# Altium schematic sheet DayGreen_revres_v00.SchDoc
size A2
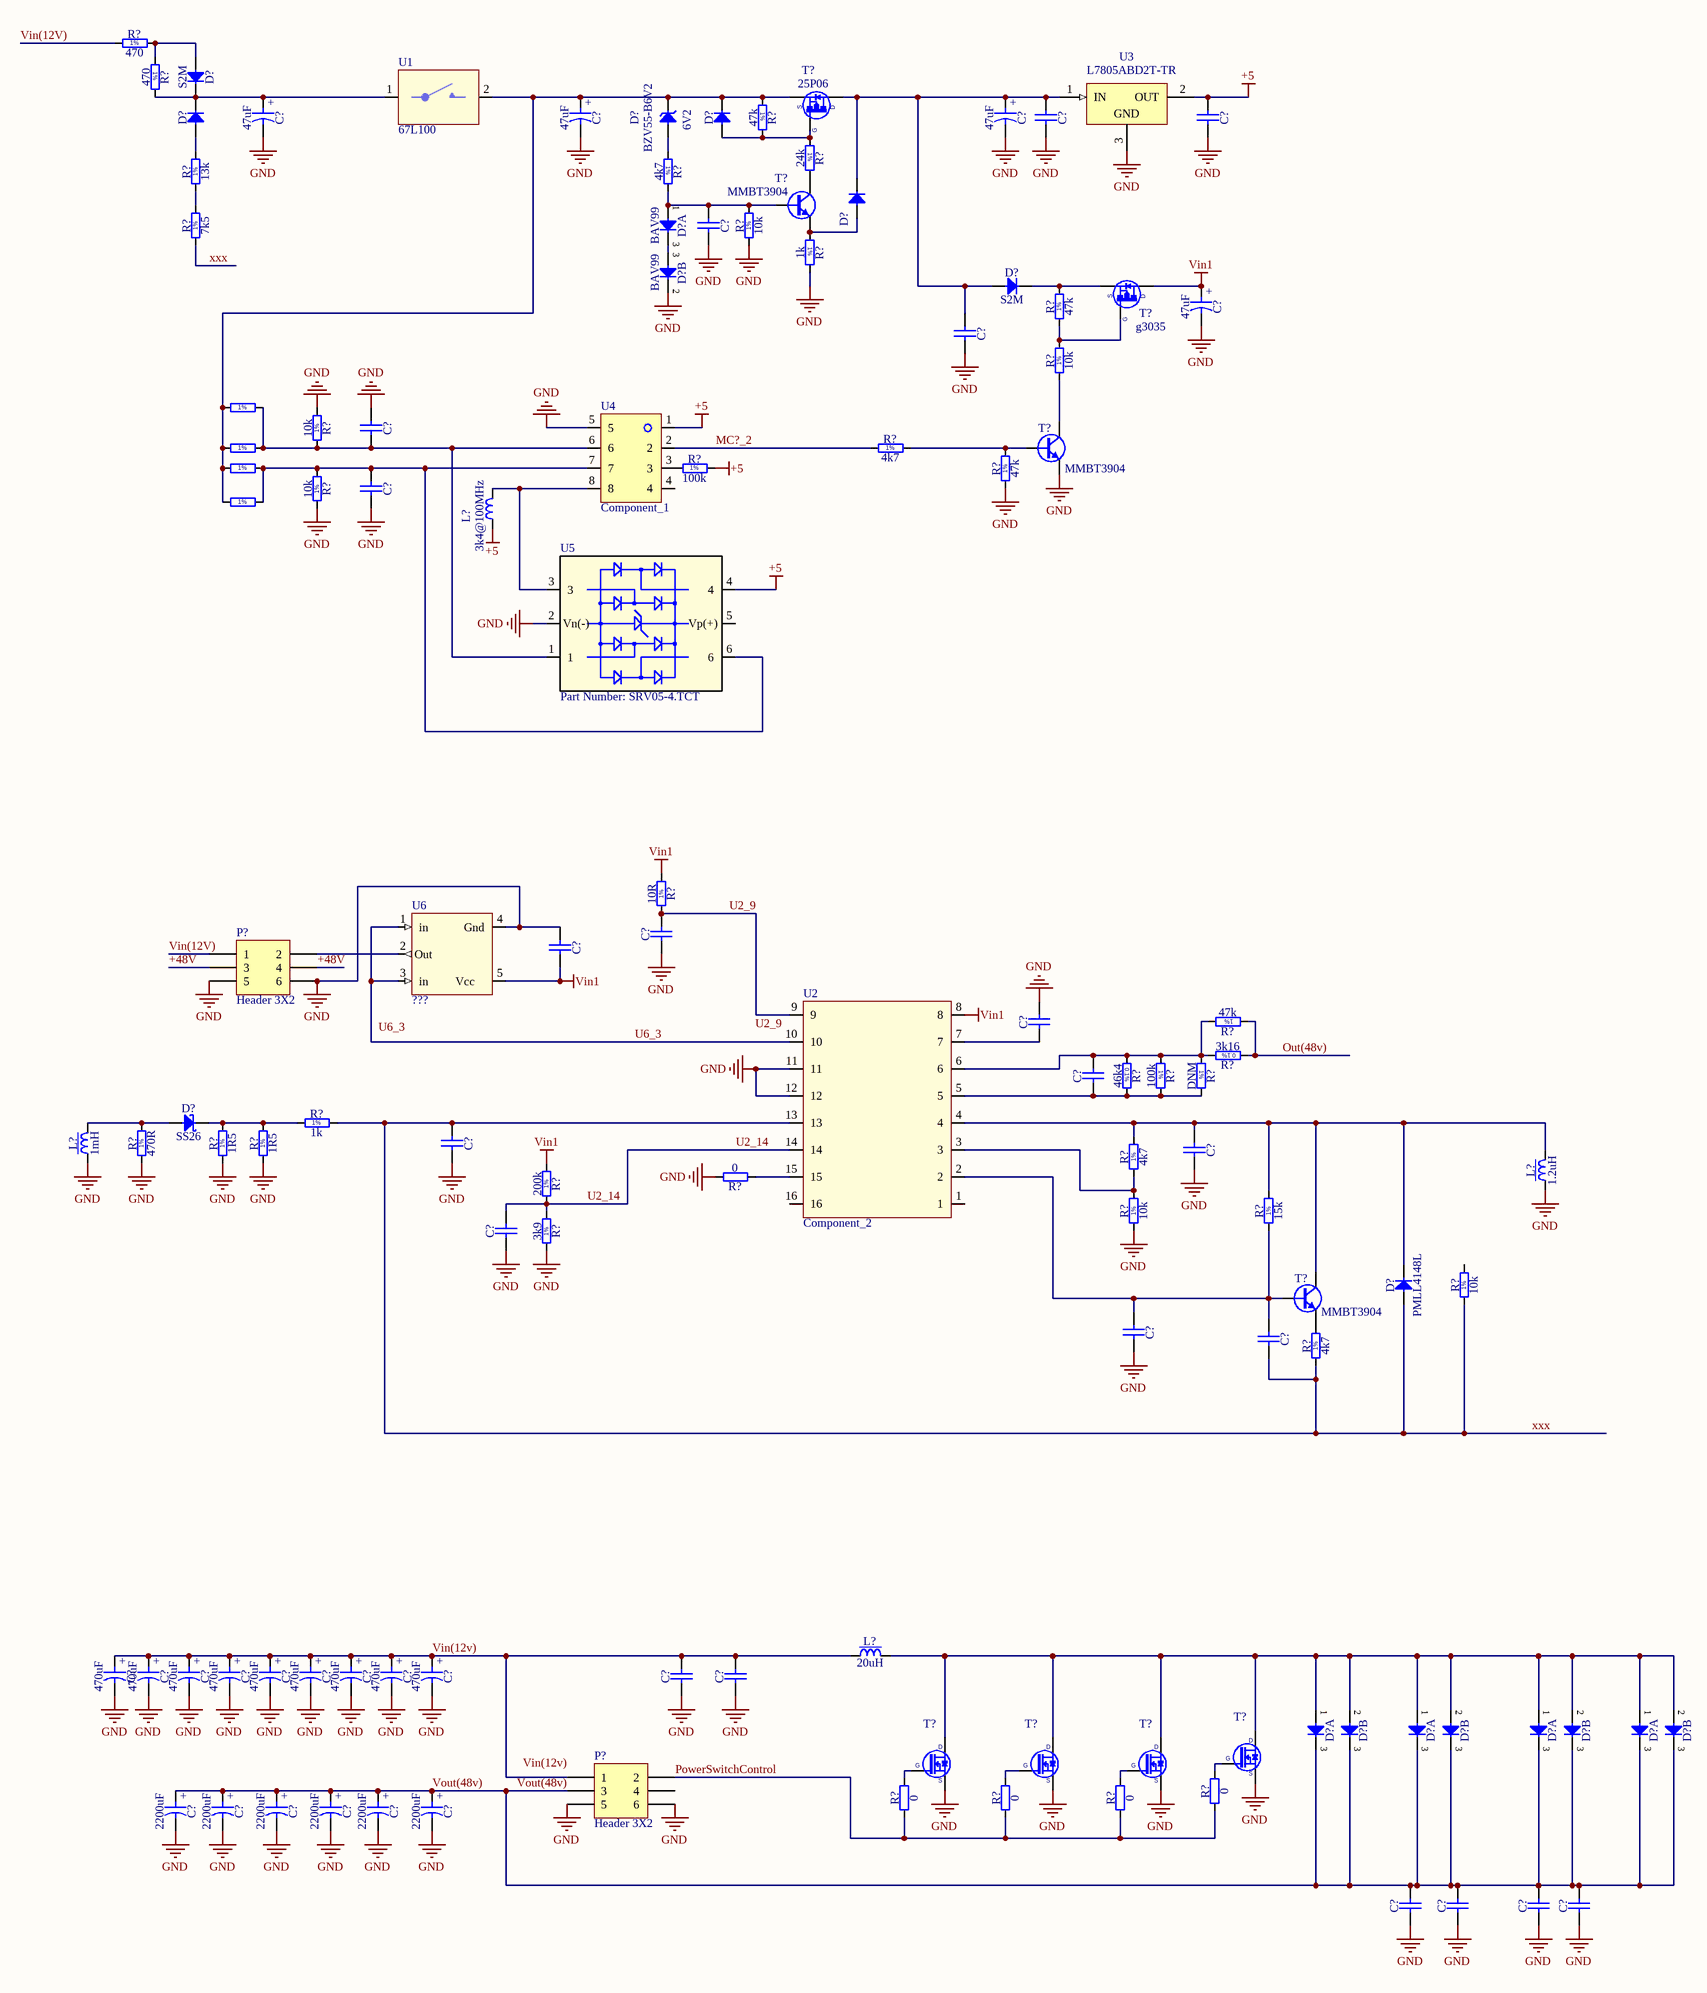
[diagram p0: DayGreen_revres_v00.SchDoc]

## Parts
(Parts that share a designator on the sheet are numbered #1, #2 ... from top to bottom, then left to right.)
C?#1  47uF  [CAPPR350-800X1150]
C?#2  47uF  [CAPPR350-800X1150]
C?#3  47uF  [CAPPR350-800X1150]
C?#4  1nF  [CAPC2012X88N]  (value not drawn)
C?#5  1nF  [CAPC2012X88N]  (value not drawn)
C?#6  1nF  [CAPC2012X88N]  (value not drawn)
C?#7  47uF  [CAPPR350-800X1150]
C?#8  1nF  [CAPC2012X88N]  (value not drawn)
C?#9  100nF  [CAPC1608X87N]  (value not drawn)
C?#10  100nF  [CAPC1608X87N]  (value not drawn)
C?#11  1nF  [CAPC2012X88N]  (value not drawn)
C?#12  1nF  [CAPC2012X88N]  (value not drawn)
C?#13  1nF  [CAPC2012X88N]  (value not drawn)
C?#14  1nF  [CAPC2012X88N]  (value not drawn)
C?#15  1nF  [CAPC2012X88N]  (value not drawn)
C?#16  1nF  [CAPC2012X88N]  (value not drawn)
C?#17  1nF  [CAPC2012X88N]  (value not drawn)
C?#18  1nF  [CAPC2012X88N]  (value not drawn)
C?#19  1nF  [CAPC2012X88N]  (value not drawn)
C?#20  470uF  [CAPPR500-1300X3200]
C?#21  470uF  [CAPPR500-1300X3200]
C?#22  470uF  [CAPPR500-1300X3200]
C?#23  470uF  [CAPPR500-1300X3200]
C?#24  470uF  [CAPPR500-1300X3200]
C?#25  470uF  [CAPPR500-1300X3200]
C?#26  470uF  [CAPPR500-1300X3200]
C?#27  470uF  [CAPPR500-1300X3200]
C?#28  470uF  [CAPPR500-1300X3200]
C?#29  100nF  [CAPC3216X140N]  (value not drawn)
C?#30  100nF  [CAPC3216X140N]  (value not drawn)
C?#31  2200uF  [CAPPR750-1650X2200]
C?#32  2200uF  [CAPPR750-1650X2200]
C?#33  2200uF  [CAPPR750-1650X2200]
C?#34  2200uF  [CAPPR750-1650X2200]
C?#35  2200uF  [CAPPR750-1650X2200]
C?#36  2200uF  [CAPPR750-1650X2200]
C?#37  100nF  [CAPC3216X140N]  (value not drawn)
C?#38  100nF  [CAPC3216X140N]  (value not drawn)
C?#39  100nF  [CAPC3216X140N]  (value not drawn)
C?#40  100nF  [CAPC3216X140N]  (value not drawn)
D?#1  S2M  [DIOM5336X265N]
D?#2  PMLL4148L  [DIOMELF3515N]  (value not drawn)
D?#3  BZV55-B6V2  Voltage: 6V2  [DIOMELF3515N]
D?#4  PMLL4148L  [DIOMELF3515N]  (value not drawn)
D?#5  BAV99  [SOT95P240X110-3N]  (part A of 2)
D?#6  PMLL4148L  [DIOMELF3515N]  (value not drawn)
D?#7  BAV99  [SOT95P240X110-3N]  (part B of 2)
D?#8  S2M  [DIOM5336X265N]
D?#9  SS26  [DIOM5336X265N]
D?#10  PMLL4148L  [DIOMELF3515N]
D?#11  STPS41H100C  [TO254P1542X460-3N-R820X1040]  (value not drawn)  (part A of 2)
D?#12  STPS41H100C  [TO254P1542X460-3N-R820X1040]  (value not drawn)  (part B of 2)
D?#13  STPS41H100C  [TO254P1542X460-3N-R820X1040]  (value not drawn)  (part A of 2)
D?#14  STPS41H100C  [TO254P1542X460-3N-R820X1040]  (value not drawn)  (part B of 2)
D?#15  STPS41H100C  [TO254P1542X460-3N-R820X1040]  (value not drawn)  (part A of 2)
D?#16  STPS41H100C  [TO254P1542X460-3N-R820X1040]  (value not drawn)  (part B of 2)
D?#17  STPS41H100C  [TO254P1542X460-3N-R820X1040]  (value not drawn)  (part A of 2)
D?#18  STPS41H100C  [TO254P1542X460-3N-R820X1040]  (value not drawn)  (part B of 2)
L?#1  3k4@100MHz  [INDC2012X110N]
L?#2  1mH  [IND_BOURNS_2124-V-RC]
L?#3  1.2uH  [INDC2014X145N]
L?#4  20uH  [IND_COOPER_CTX20-16-52-R]
P?#1  Header 3X2  [HDR2X3]
P?#2  Header 3X2  [HDR2X3]
R?#1  470  [RESC3146X65N]
R?#2  470  [RESC3146X65N]
R?#3  47k  [RESC2012X60N]
R?#4  24k  [RESC3216X65N]
R?#5  4k7  [RESC2012X60N]
R?#6  13k  [RESC2012X60N]
R?#7  1k  [RESC3216X65N]
R?#8  7k5  [RESC2012X60N]
R?#9  10k  [RESC1608X55N]
R?#10  47k  [RESC1608X55N]
R?#11  10k  [RESC1608X55N]
R?#12  10k  [RESC1608X55N]  (value not drawn)
R?#13  10k  [RESC1608X55N]  (value not drawn)
R?#14  10k  [RESC1608X55N]
R?#15  4k7  [RESC1608X55N]
R?#16  10k  [RESC1608X55N]  (value not drawn)
R?#17  100k  [RESC1608X55N]
R?#18  47k  [RESC1608X55N]
R?#19  10k  [RESC1608X55N]  (value not drawn)
R?#20  10k  [RESC1608X55N]
R?#21  10R  [RESC2012X60N]
R?#22  47k  [RESC2012X60N]
R?#23  46k4  [RESC2012X60N]
R?#24  100k  [RESC2012X60N]
R?#25  DNM  [RESC2012X60N]
R?#26  3k16  [RESC2012X60N]
R?#27  1k  [RESC2012X60N]
R?#28  470R  [RESC3216X65N]
R?#29  1R5  [RESC3225X70N]
R?#30  1R5  [RESC3225X70N]
R?#31  0  [RESC2012X60N]
R?#32  4k7  [RESC2012X60N]
R?#33  200k  [RESC2012X60N]
R?#34  10k  [RESC2012X60N]
R?#35  15k  [RESC2012X60N]
R?#36  3k9  [RESC2012X60N]
R?#37  10k  [RESC2012X60N]
R?#38  4k7  [RESC2012X60N]
R?#39  0  [RESC2012X60N]
R?#40  0  [RESC2012X60N]
R?#41  0  [RESC2012X60N]
R?#42  0  [RESC2012X60N]
T?#1  25P06  [TO254P1524X483-3N-R1067X686]
T?#2  MMBT3904  [SOT95P230X110-3N]
T?#3  g3035  [SOT95P240X130-3N]
T?#4  MMBT3904  [SOT95P230X110-3N]
T?#5  MMBT3904  [SOT95P230X110-3N]
T?#6  HY4008  [TO228P991X239-3N-R552X520]  (value not drawn)
T?#7  HY4008  [TO228P991X239-3N-R552X520]  (value not drawn)
T?#8  HY4008  [TO228P991X239-3N-R552X520]  (value not drawn)
T?#9  HY4008  [TO228P991X239-3N-R552X520]  (value not drawn)
U1  67L100
U2  Component_2
U3  L7805ABD2T-TR  [TO254P1542X460-3N-R790X1040]
U4  Component_1
U5  Part Number: SRV05-4.TCT  [SO6_SOT23-6L]
U6  ???

## Nets
+5: C?#5.1 L?#1.1 R?#17.1 U3.2(OUT) U4.1 U5.4
GND: C?#1.2 C?#2.2 C?#3.2 C?#4.2 C?#5.2 C?#6.2 C?#7.2 C?#8.2 C?#9.2 C?#10.1 C?#11.1 C?#12.1 C?#13.1 C?#15.1 C?#16.1 C?#17.1 C?#18.1 C?#20.2 C?#21.2 C?#22.2 C?#23.2 C?#24.2 C?#25.2 C?#26.2 C?#27.2 C?#28.2 C?#29.1 C?#30.1 C?#31.2 C?#32.2 C?#33.2 C?#34.2 C?#35.2 C?#36.2 C?#37.1 C?#38.1 C?#39.1 C?#40.1 D?#7.2(C) L?#2.1 L?#3.1 P?#1.5 P?#1.6 P?#2.5 P?#2.6 R?#7.2 R?#9.1 R?#14.2 R?#18.1 R?#20.1 R?#28.1 R?#29.1 R?#30.1 R?#31.2 R?#34.1 R?#36.1 T?#4.2(E) T?#6.2(S) T?#7.2(S) T?#8.2(S) T?#9.2(S) U2.11 U2.12 U3.3(GND) U4.5 U5.2(Vn(-)) U6.4(Gnd)
Vin1: C?#7.1 C?#11.2 R?#21.2 R?#33.2 T?#3.3(D) U2.8 U6.5(Vcc)
+48V: P?#1.3 P?#1.4
MC?_2: R?#15.1 U4.2
Out(48v): R?#22.1 R?#26.1
PowerSwitchControl: P?#2.2 R?#39.1 R?#40.1 R?#41.1 R?#42.1
U2_9: C?#12.2 R?#21.1 U2.9
U2_14: C?#17.2 R?#33.1 R?#36.2 U2.14
U6_3: U2.10 U6.1(in) U6.3(in)
Vin(12V): C?#20.1 C?#21.1 C?#22.1 C?#23.1 C?#24.1 C?#25.1 C?#26.1 C?#27.1 C?#28.1 C?#29.2 C?#30.2 L?#4.1 P?#1.1 P?#2.1 R?#1.1
Vout(48v): C?#31.1 C?#32.1 C?#33.1 C?#34.1 C?#35.1 C?#36.1 C?#37.2 C?#38.2 C?#39.2 C?#40.2 D?#11.3(COMC) D?#12.3(COMC) D?#13.3(COMC) D?#14.3(COMC) D?#15.3(COMC) D?#16.3(COMC) D?#17.3(COMC) D?#18.3(COMC) P?#2.3
xxx: C?#15.2 C?#19.1 D?#10.2(A) R?#8.1 R?#27.2 R?#37.1 R?#38.1 U2.13
NetC?#1_1: C?#1.1 D?#1.1(C) D?#2.1(C) R?#2.2 U1.1
NetC?#2_1: C?#2.1 D?#3.1(C) D?#4.1(C) R?#3.1 R?#12.2 R?#13.2 R?#16.2 R?#19.2 T?#1.2(S) U1.2
NetC?#3_1: C?#3.1 C?#4.1 C?#8.1 D?#6.1(C) D?#8.2(A) T?#1.3(D) U3.1(IN)
NetC?#6_1: C?#6.1 D?#5.1(A) R?#5.2 R?#9.2 T?#2.1(B)
NetC?#9_1: C?#9.1 R?#12.1 R?#13.1 R?#14.1 U4.6 U5.1
NetC?#10_2: C?#10.2 R?#16.1 R?#19.1 R?#20.2 U4.7 U5.6
NetC?#13_2: C?#13.2 U2.7
NetC?#14_1: C?#14.1 R?#22.2 R?#23.1 R?#24.1 R?#25.1 R?#26.2 U2.6
NetC?#14_2: C?#14.2 R?#23.2 R?#24.2 R?#25.2 U2.5
NetC?#16_2: C?#16.2 D?#10.1(C) L?#3.2 R?#32.2 R?#35.2 T?#5.3(C) U2.4
NetC?#18_2: C?#18.2 C?#19.2 R?#35.1 T?#5.1(B) U2.2
NetD?#1_2: D?#1.2(A) R?#1.2 R?#2.1
NetD?#2_2: D?#2.2(A) R?#6.2
NetD?#3_2: D?#3.2(A) R?#5.1
NetD?#4_2: D?#4.2(A) R?#3.2 R?#4.1 T?#1.1(G)
NetD?#5_3: D?#5.3(COMAC) D?#7.3(COMAC)
NetD?#6_2: D?#6.2(A) R?#7.1 T?#2.2(E)
NetD?#8_1: D?#8.1(C) R?#10.2 T?#3.2(S)
NetD?#9_1: D?#9.1(C) R?#27.1 R?#29.2 R?#30.2
NetD?#9_2: D?#9.2(A) L?#2.2 R?#28.2
NetD?#11_1: D?#11.1(A) D?#12.2(A) D?#13.1(A) D?#14.2(A) D?#15.1(A) D?#16.2(A) D?#17.1(A) D?#18.2(A) L?#4.2 T?#6.3(D) T?#7.3(D) T?#8.3(D) T?#9.3(D)
NetL?#1_2: L?#1.2 U4.8 U5.3
NetP?#1_2: P?#1.2 U6.2(Out)
NetR?#4_2: R?#4.2 T?#2.3(C)
NetR?#6_1: R?#6.1 R?#8.2
NetR?#10_1: R?#10.1 R?#11.2 T?#3.1(G)
NetR?#11_1: R?#11.1 T?#4.3(C)
NetR?#15_2: R?#15.2 R?#18.2 T?#4.1(B)
NetR?#17_2: R?#17.2 U4.3
NetR?#31_1: R?#31.1 U2.15
NetR?#32_1: R?#32.1 R?#34.2 U2.3
NetR?#38_2: R?#38.2 T?#5.2(E)
NetR?#39_2: R?#39.2 T?#6.1(G)
NetR?#40_2: R?#40.2 T?#7.1(G)
NetR?#41_2: R?#41.2 T?#8.1(G)
NetR?#42_2: R?#42.2 T?#9.1(G)

Not connected (* = marked no-connect by the designer): P?#2 4; R?#37 2; U2 1 16; U4 4; U5 5(Vp(+))

## Notes on the sheet
- Labels drawn without touching a wire or pin: U6_3, Vin(12v)
- Title
- Size:
- Date:
- File:
- A2
- Number:
- Time:
- Revision:
- Sheet
- of
- (in symbol CAER_47UF_63V_20%_350-800X1150) +
- (in symbol CAER_470UF_63V_20%_PANASONIC_EEUFC1J471L) +
- (in symbol CAER_2200UF_25V_20%_RUBYCON_ZLH) +
- (in symbol R0603_4K7_1%_0.1W_100PPM) 1%
- (in symbol R0603_10K_1%_0.1W_100PPM) 1%
- (in symbol R0603_47K_1%_0.1W_100PPM) 1%
- (in symbol R0603_100K_1%_0.1W_100PPM) 1%
- (in symbol R0805_1K_1%_0.33W_100PPM_VISHAY_CRCW-HP) 1%
- (in symbol R0805_1K_1%_0.125W_100PPM) 1%
- (in symbol R0805_3K9_1%_0.125W_100PPM) 1%
- (in symbol R0805_3K16_0.1%_0.1W_10PPM) 0.1%
- (in symbol R0805_4K7_1%_0.125W_100PPM) 1%
- (in symbol R0805_7K5_1%_0.125W_100PPM) 1%
- (in symbol R0805_10K_1%_0.125W_100PPM) 1%
- (in symbol R0805_13K_1%_0.125W_100PPM) 1%
- (in symbol R0805_15K_1%_0.125W_100PPM) 1%
- (in symbol R0805_46K4_0.1%_0.1W_10PPM) 0.1%
- (in symbol R0805_47K_1%_0.125W_100PPM) 1%
- (in symbol R0805_100K_1%_0.125W_100PPM) 1%
- (in symbol R0805_200K_1%_0.125W_100PPM) 1%
- (in symbol R1206_1K_1%_0.25W_100PPM) 1%
- (in symbol R1206_24K_1%_0.25W_100PPM) 1%
- (in symbol R1206_24R_1%_0.25W_100PPM) 1%
- (in symbol R1210_49R9_1%_0.5W_100PPM_VISHAY_CRCW) 1%
- (in symbol R1218_470R_1%_1W_100PPM) 1%

## Library data of the parts
C?#1-C?#3 C?#7 = CAER_47UF_63V_20%_350-800X1150: Polarised capacitor; Part Description: Aluminum Electrolytic Capacitor; Manufacturer: GENERIC; Manufacturer1 Part Number: EEUFC1J470; Voltage: 63V; Tolerance: ±20%; Part Number: CAER_47UF_63V_20%_350-800X1150; Component Kind: Standard; Component Type: Standard; Pin Count: 2; Value: 47uF; Status: Preferred; Manufacturer Part Number: CAER_47UF_63V_20%_350-800X1150; Case: LS3.5 D8 x H11.5; Mounted: Yes; Socket: No; SMD: No; Sense: No; ComponentHeight: 11.5mm; Manufacturer1 Example: PANASONIC; Manufacturer1 ComponentHeight: 11.5mm; HelpURL: \\cern.ch\dfs\Applications\Altium\Datasheets\CAER_PANASONIC_FC.pdf; Author: CERN DEM JLC; CreateDate: 18.12.2007; LatestRevisionDate: 18.12.2007
C?#4-C?#6 C?#8 C?#11-C?#19 = CC0805_1NF_50V_5%_C0G_KEMET_C0805C102J5GACAUTO: Non-polarised capacitor; Part Description: SMD Multilayer Chip Ceramic Capacitor (Automotive Grade); Manufacturer: KEMET; Voltage: 50V; TC: C0G/NP0; Tolerance: ±5%; Part Number: CC0805_1NF_50V_5%_C0G_KEMET_C0805C102J5GACAUTO; Component Kind: Standard; Component Type: Standard; Pin Count: 2; Value: 1nF; Status: Not Recommended; Manufacturer Part Number: C0805C102J5GACAUTO; Case: 0805; Mounted: Yes; Socket: No; SMD: Yes; Sense: No; ComponentHeight: 0.88mm; HelpURL: \\cern.ch\dfs\Applications\Altium\Datasheets\CC0805_KEMET_C0805C102J5GACAUTO.pdf; Author: CERN DEM BC
  C?#4-C?#6 C?#8 C?#11: CreateDate: 26.02.2016; LatestRevisionDate: 26.02.2016
  C?#12-C?#19: CreateDate: 2/26/2016; LatestRevisionDate: 2/26/2016
C?#9 C?#10 = CC0603_100NF_50V_10%_X5R: Non-polarised capacitor; Part Description: SMD Multilayer Chip Ceramic Capacitor; Manufacturer: GENERIC; Manufacturer1 Part Number: C1608X5R1H104K080AA; Voltage: 50V; TC: X5R; Tolerance: ±10%; Part Number: CC0603_100NF_50V_10%_X5R; Component Kind: Standard; Component Type: Standard; Pin Count: 2; Value: 100nF; Status: None; Manufacturer Part Number: CC0603_100NF_50V_10%_X5R; Case: 0603; Mounted: Yes; Socket: No; SMD: Yes; Sense: No; Manufacturer1 Example: TDK; Manufacturer1 ComponentHeight: 0.9mm; HelpURL: \\cern.ch\dfs\Applications\Altium\Datasheets\CC0603_X5R_TDK_C.pdf; Author: CERN DEM MR; CreateDate: 08.01.2016; LatestRevisionDate: 08.01.2016
C?#20-C?#28 = CAER_470UF_63V_20%_PANASONIC_EEUFC1J471L: Polarised capacitor; Part Description: Z= 0R055, Radial Lead, Aluminum Electrolytic Capacitor, (FC Series, Type A); Voltage: 63V; Tolerance: ±20%; Part Number: CAER_470UF_63V_20%_PANASONIC_EEUFC1J471L; Component Kind: Standard; Component Type: Standard; Pin Count: 2; Value: 470uF; Status: None; Manufacturer: PANASONIC; Manufacturer Part Number: EEUFC1J471L; Case: LS5 D12.5 x H30; Mounted: Yes; Socket: No; SMD: No; Sense: No; ComponentHeight: 32mm; HelpURL: \\cern.ch\dfs\Applications\Altium\Datasheets\CAER_PANASONIC_FC-A.pdf; Author: CERN DEM MR; CreateDate: 17.02.2016; LatestRevisionDate: 17.02.2016
C?#29 C?#30 C?#37-C?#40 = CC1206_100NF_200V_10%_X7R: Non-polarised capacitor; Part Description: SMD Ceramic Chip Capacitor; Manufacturer: GENERIC; Manufacturer1 Part Number: C1206C104K2RAC; Voltage: 200V; TC: X7R; Tolerance: ±10%; Part Number: CC1206_100NF_200V_10%_X7R; Component Kind: Standard; Component Type: Standard; Pin Count: 2; Value: 100nF; Status: None; Manufacturer Part Number: CC1206_100NF_200V_10%_X7R; Case: 1206; Mounted: Yes; Socket: No; SMD: Yes; Sense: No; Manufacturer1 Example: KEMET; Manufacturer1 ComponentHeight: 1.4mm; HelpURL: \\cern.ch\dfs\Applications\Altium\Datasheets\CC1206_X7R_KEMET.pdf; Author: CERN DEM JLC; CreateDate: 16.09.2009; LatestRevisionDate: 16.09.2009
C?#31-C?#36 = CAER_2200UF_25V_20%_RUBYCON_ZLH: Polarised capacitor; Part Description: Miniature Aluminum Electrolytic Capacitor (Series: ZLH); Manufacturer Part Number: 25ZLH2200MEFC16X20; Voltage: 25V; Tolerance: ±20%; Part Number: CAER_2200UF_25V_20%_RUBYCON_ZLH; Component Kind: Standard; Component Type: Standard; Pin Count: 2; Value: 2200uF; Status: Preferred; Manufacturer: RUBYCON; Case: LS7.5 D16.5 x H22; Mounted: Yes; Socket: No; SMD: No; Sense: No; ComponentHeight: 22mm; HelpURL: \\cern.ch\dfs\Applications\Altium\Datasheets\CAER_RUBYCON_ZLH.pdf; Author: CERN DEM JLC; CreateDate: 03.07.2012; LatestRevisionDate: 03.07.2012
D?#1 D?#8 = S2M: Diode; Part Description: General Purpose Rectifiers (Glass Passivated); Manufacturer: FAIRCHILD SEMICONDUCTOR; Voltage: 1000V; Power: 2A; PressFit: No; Bonding: No; Part Number: S2M; Component Kind: Standard; Component Type: Standard; Device: S2M; PackageDescription: DO-214-AA/SMB Diode, Molded Body; 5.34mm L X 3.625mm W X 2.65mm H, IPC Medium Density; Manufacturer Part Number: S2M; Pin Count: 2; Case: DO-214AA; Mounted: Yes; Socket: No; SMD: Yes; Sense: No; ComponentHeight: 2.65mm; HelpURL: \\cern.ch\dfs\Applications\Altium\Datasheets\S2M.pdf; Author: CERN DEM JLC; CreateDate: 26.04.2011; LatestRevisionDate: 26.04.2011
D?#2 D?#4 D?#6 D?#10 = PMLL4148L: Diode; Part Description: High-speed switching diodes; Manufacturer: NXP SEMICONDUCTORS; Voltage: 75V; Power: 200mA; PressFit: No; Bonding: No; Part Number: PMLL4148L; Component Kind: Standard; Component Type: Standard; Device: PMLL4148L; PackageDescription: SOD80C, MELF Diode, 2-Leads, Body 3.5x1.5mm, IPC Medium Density; Status: Not recommended; Manufacturer Part Number: PMLL4148L; Pin Count: 2; Case: SOD-80C; Mounted: Yes; Socket: No; SMD: Yes; Sense: No; ComponentHeight: 1.6mm; HelpURL: \\cern.ch\dfs\Applications\Altium\Datasheets\PMLL4148L.pdf; Author: CERN DEM JLC
  D?#2 D?#4 D?#6: CreateDate: 30.03.2009; LatestRevisionDate: 09.12.2009
  D?#10: CreateDate: 3/30/2009; LatestRevisionDate: 12/9/2009
D?#3 = BZV55-B6V2: Zener Diode; Part Description: Voltage Regulator Diode; Manufacturer: NXP SEMICONDUCTORS; Power: 500mW; PressFit: No; Bonding: No; Part Number: BZV55-B6V2; Component Kind: Standard; Component Type: Standard; Device: BZV55-B6V2; PackageDescription: SOD80C, MELF Diode, 2-Leads, Body 3.5x1.5mm, IPC Medium Density; Manufacturer Part Number: BZV55-B6V2; Pin Count: 2; Case: SOD-80C; Mounted: Yes; Socket: No; SMD: Yes; Sense: No; ComponentHeight: 1.6mm; HelpURL: \\cern.ch\dfs\Applications\Altium\Datasheets\BZV55.pdf; Author: CERN DEM JLC; CreateDate: 5/6/2008; LatestRevisionDate: 5/6/2008
D?#5 D?#7 = BAV99: Serial Diode; Part Description: Dual Series Signal Diode; Manufacturer: FAIRCHILD SEMICONDUCTOR; Voltage: 70V; Power: 350mW; PressFit: No; Bonding: No; Part Number: BAV99; Component Kind: Standard; Component Type: Standard; Device: BAV99; PackageDescription: SOT23 3-Leads, Pitch 0.95mm - Body 1.4x3mm, IPC Medium Density; Manufacturer Part Number: BAV99; Pin Count: 3; Case: SOT23-3; Mounted: Yes; Socket: No; SMD: Yes; Sense: No; ComponentHeight: 1.1mm; HelpURL: \\cern.ch\dfs\Applications\Altium\Datasheets\BAV99.pdf; Author: CERN DEM JLC; CreateDate: 5/6/2008; LatestRevisionDate: 9/27/2012
D?#9 = SS26: Schottky Diode; Part Description: Schottky Rectifier; Manufacturer: FAIRCHILD SEMICONDUCTOR; Voltage: 60V; Power: 2A; PressFit: No; Bonding: No; Part Number: SS26; Component Kind: Standard; Component Type: Standard; Device: SS26; PackageDescription: DO-214-AA/SMB Diode, Molded Body; 5.34mm L X 3.625mm W X 2.65mm H, IPC Medium Density; Manufacturer Part Number: SS26; Pin Count: 2; Case: DO-214AA; Mounted: Yes; Socket: No; SMD: Yes; Sense: No; ComponentHeight: 2.65mm; HelpURL: \\cern.ch\dfs\Applications\Altium\Datasheets\SS26.pdf; Author: CERN DEM JMW; CreateDate: 7/10/2015; LatestRevisionDate: 7/10/2015
D?#11-D?#18 = STTH16L06CG-TR: Dual Common Cathode Diodes; Part Description: Turbo 2 Ultrafast High Voltage Rectifier (Common Cathode); Manufacturer: ST MICROELECTRONICS; Voltage: 30V; Power: 7A; PressFit: No; Bonding: No; Part Number: STTH16L06CG-TR; Component Kind: Standard; Component Type: Standard; Device: STPS41H100C; PackageDescription: D2PAK TO-263, TO, 2.54mm pitch; 2 pin,15.425mm L X 9.15mm W X 4.60mm H body, IPC Medium Density; Manufacturer Part Number: STTH16L06CG-TR; Pin Count: 3; Case: D2PAK; Mounted: Yes; Socket: No; SMD: Yes; Sense: No; ComponentHeight: 4.6mm; HelpURL: \\cern.ch\dfs\Applications\Altium\Datasheets\STTH16L06CG-TR.pdf; Author: CERN DEM JLC; CreateDate: 22.05.2013; LatestRevisionDate: 04.10.2016
L?#1 = IND0805_WURTH_742792097: Inductor; Part Description: SMD EMI Suppression Chip Ferrite Bead (WE-CBF Series); Manufacturer: WURTH ELEKTRONIK; Power: 1A; Resistance: 0.3R; Tolerance: ±25%; Part Number: IND0805_WURTH_742792097; Component Kind: Standard; Component Type: Standard; Pin Count: 2; Value: 3k4@100MHz; Status: None; Manufacturer Part Number: 742792097; Case: 0805; Mounted: Yes; Socket: No; SMD: Yes; Sense: No; ComponentHeight: 1.1mm; HelpURL: \\cern.ch\dfs\Applications\Altium\Datasheets\IND0805_WURTH_742792097.pdf; Author: CERN DEM MR; CreateDate: 29.06.2017; LatestRevisionDate: 29.06.2017
L?#2 = IND_1MH_BOURNS_2124-V-RC: Inductor With Core; Part Description: High Current Vertical Leaded Toroid Inductor; Manufacturer: BOURNS; Power: 1.3A; Resistance: 0.4R; Tolerance: ±15%; Part Number: IND_1MH_BOURNS_2124-V-RC; Component Kind: Standard; Component Type: Standard; Pin Count: 2; Value: 1mH; Manufacturer Part Number: 2124-V-RC; Case: LS9.39 D21.84 x W11.43; Mounted: Yes; Socket: No; SMD: No; Sense: No; ComponentHeight: 21.84mm; HelpURL: \\cern.ch\dfs\Applications\Altium\Datasheets\IND_BOURNS_2124-V-RC.pdf; Author: CERN DEM JLC; CreateDate: 3/2/2015; LatestRevisionDate: 3/2/2015
L?#3 = IND0805_1.2UH_5%_EPCOS_B82498B: Inductor With Core; Part Description: SMT Inductor SIMID Series; Manufacturer: EPCOS; Manufacturer Part Number: B82498B1122J; Power: 220mA; Resistance: 0.65R; Tolerance: ±5%; Part Number: IND0805_1.2UH_5%_EPCOS_B82498B; Component Kind: Standard; Component Type: Standard; Pin Count: 2; Value: 1.2uH; Status: Preferred; Case: 0805; Mounted: Yes; Socket: No; SMD: Yes; Sense: No; ComponentHeight: 1.45mm; HelpURL: \\cern.ch\dfs\Applications\Altium\Datasheets\IND0805_EPCOS_B82498B.pdf; Author: CERN DEM JLC; CreateDate: 2/11/2008; LatestRevisionDate: 6/26/2008
L?#4 = IND_20UH_20%_COOPER_CTX20-16-52-R: Inductor With Core; Part Description: Vertical Leaded Toroidal Inductor; Manufacturer: COOPER BUSSMANN; Power: 31.5A; Resistance: 0.0034R; Tolerance: ±20%; Part Number: IND_20UH_20%_COOPER_CTX20-16-52-R; Component Kind: Standard; Component Type: Standard; Pin Count: 2; Value: 20uH; Manufacturer Part Number: CTX20-16-52-R; Case: LS23 D59 x W28; Mounted: Yes; Socket: No; SMD: No; Sense: No; ComponentHeight: 59mm; HelpURL: \\cern.ch\dfs\Applications\Altium\Datasheets\IND_COOPER_CTX20-16-52-R.pdf; Author: CERN DEM JLC; CreateDate: 18.04.2012; LatestRevisionDate: 23.08.2017
P?#1 P?#2 = Header 3X2: Header, 3-Pin, Dual row; LatestRevisionDate: 17-Jul-2002; LatestRevisionNote: Re-released for DXP Platform.; Publisher: Altium Limited
R?#1 R?#2 = R1218_470R_1%_1W_100PPM: Resistor - 1%; Part Description: Thick Film Chip Resistor; Manufacturer: GENERIC; Manufacturer1 Part Number: 232273574701L or RC1218FK-07470RL; Power: 1W; TC: ±100ppm/°C; PressFit: No; Part Number: R1218_470R_1%_1W_100PPM; Component Kind: Standard; Component Type: Standard; Pin Count: 2; Value: 470; Status: Not Recommended; Tolerance: ±1%; Manufacturer Part Number: R1218_470R_1%_1W_100PPM; Case: 1218; Mounted: Yes; Sense: No; Socket: No; SMD: Yes; Manufacturer1 Example: YAGEO PHYCOMP; Manufacturer1 ComponentHeight: 0.65mm; HelpURL: \\cern.ch\dfs\Applications\Altium\Datasheets\R1218_Phycomp_RC1218.pdf; Author: CERN DEM JLC; CreateDate: 26.04.2011; LatestRevisionDate: 17.10.2012
R?#3 = R0805_47K_1%_0.125W_100PPM: Resistor - 1%; Part Description: General Purpose Thick Film Chip Resistor; Manufacturer: GENERIC; Manufacturer1 Part Number: NRC10F4702TRF; Power: 0.125W; TC: ±100ppm/°C; PressFit: No; Part Number: R0805_47K_1%_0.125W_100PPM; Component Kind: Standard; Component Type: Standard; Pin Count: 2; Value: 47k; Status: Preferred; Tolerance: ±1%; Manufacturer Part Number: R0805_47K_1%_0.125W_100PPM; Case: 0805; Mounted: Yes; Sense: No; Socket: No; SMD: Yes; Manufacturer1 Example: NIC COMPONENT; Manufacturer1 ComponentHeight: 0.6mm; HelpURL: \\cern.ch\dfs\Applications\Altium\Datasheets\R0805_NIC_NRC.pdf; Author: CERN DEM JLC; CreateDate: 03.12.2007; LatestRevisionDate: 13.03.2008
R?#4 = R1206_24K_1%_0.25W_100PPM: Resistor - 1%; Part Description: General Purpose Thick Film Chip Resistor; Manufacturer: GENERIC; Manufacturer1 Part Number: NRC12F2402TRF; Power: 0.25W; TC: ±100ppm/°C; PressFit: No; Part Number: R1206_24K_1%_0.25W_100PPM; Component Kind: Standard; Component Type: Standard; Pin Count: 2; Value: 24k; Status: Preferred; Tolerance: ±1%; Manufacturer Part Number: R1206_24K_1%_0.25W_100PPM; Case: 1206; Mounted: Yes; Sense: No; Socket: No; SMD: Yes; Manufacturer1 Example: NIC COMPONENT; Manufacturer1 ComponentHeight: 0.65mm; HelpURL: \\cern.ch\dfs\Applications\Altium\Datasheets\R1206_NIC_NRC.pdf; Author: CERN DEM JLC; CreateDate: 03.12.2007; LatestRevisionDate: 13.03.2008
R?#5 R?#32 R?#38 = R0805_4K7_1%_0.125W_100PPM: Resistor - 1%; Part Description: General Purpose Thick Film Chip Resistor; Manufacturer: GENERIC; Manufacturer1 Part Number: NRC10F4701TRF; Power: 0.125W; TC: ±100ppm/°C; PressFit: No; Part Number: R0805_4K7_1%_0.125W_100PPM; Component Kind: Standard; Component Type: Standard; Pin Count: 2; Value: 4k7; Status: Preferred; Tolerance: ±1%; Manufacturer Part Number: R0805_4K7_1%_0.125W_100PPM; Case: 0805; Mounted: Yes; Sense: No; Socket: No; SMD: Yes; Manufacturer1 Example: NIC COMPONENT; Manufacturer1 ComponentHeight: 0.6mm; HelpURL: \\cern.ch\dfs\Applications\Altium\Datasheets\R0805_NIC_NRC.pdf; Author: CERN DEM JLC
  R?#5: CreateDate: 03.12.2007; LatestRevisionDate: 13.03.2008
  R?#32 R?#38: CreateDate: 12/3/2007; LatestRevisionDate: 3/13/2008
R?#6 = R0805_13K_1%_0.125W_100PPM: Resistor - 1%; Part Description: General Purpose Thick Film Chip Resistor; Manufacturer: GENERIC; Manufacturer1 Part Number: NRC10F1302TRF; Power: 0.125W; TC: ±100ppm/°C; PressFit: No; Part Number: R0805_13K_1%_0.125W_100PPM; Component Kind: Standard; Component Type: Standard; Pin Count: 2; Value: 13k; Status: Preferred; Tolerance: ±1%; Manufacturer Part Number: R0805_13K_1%_0.125W_100PPM; Case: 0805; Mounted: Yes; Sense: No; Socket: No; SMD: Yes; Manufacturer1 Example: NIC COMPONENT; Manufacturer1 ComponentHeight: 0.6mm; HelpURL: \\cern.ch\dfs\Applications\Altium\Datasheets\R0805_NIC_NRC.pdf; Author: CERN DEM JLC; CreateDate: 03.12.2007; LatestRevisionDate: 13.03.2008
R?#7 = R1206_1K_1%_0.25W_100PPM: Resistor - 1%; Part Description: General Purpose Thick Film Chip Resistor; Manufacturer: GENERIC; Manufacturer1 Part Number: NRC12F1001TRF; Power: 0.25W; TC: ±100ppm/°C; PressFit: No; Part Number: R1206_1K_1%_0.25W_100PPM; Component Kind: Standard; Component Type: Standard; Pin Count: 2; Value: 1k; Status: Preferred; Tolerance: ±1%; Manufacturer Part Number: R1206_1K_1%_0.25W_100PPM; Case: 1206; Mounted: Yes; Sense: No; Socket: No; SMD: Yes; Manufacturer1 Example: NIC COMPONENT; Manufacturer1 ComponentHeight: 0.65mm; HelpURL: \\cern.ch\dfs\Applications\Altium\Datasheets\R1206_NIC_NRC.pdf; Author: CERN DEM JLC; CreateDate: 03.12.2007; LatestRevisionDate: 13.03.2008
R?#8 = R0805_7K5_1%_0.125W_100PPM: Resistor - 1%; Part Description: General Purpose Thick Film Chip Resistor; Manufacturer: GENERIC; Manufacturer1 Part Number: NRC10F7501TRF; Power: 0.125W; TC: ±100ppm/°C; PressFit: No; Part Number: R0805_7K5_1%_0.125W_100PPM; Component Kind: Standard; Component Type: Standard; Pin Count: 2; Value: 7k5; Status: Preferred; Tolerance: ±1%; Manufacturer Part Number: R0805_7K5_1%_0.125W_100PPM; Case: 0805; Mounted: Yes; Sense: No; Socket: No; SMD: Yes; Manufacturer1 Example: NIC COMPONENT; Manufacturer1 ComponentHeight: 0.6mm; HelpURL: \\cern.ch\dfs\Applications\Altium\Datasheets\R0805_NIC_NRC.pdf; Author: CERN DEM JLC; CreateDate: 03.12.2007; LatestRevisionDate: 13.03.2008
R?#9 R?#11-R?#14 R?#16 R?#19 R?#20 = R0603_10K_1%_0.1W_100PPM: Resistor - 1%; Part Description: General Purpose Thick Film Chip Resistor; Manufacturer: GENERIC; Manufacturer1 Part Number: NRC06F1002TRF; Power: 0.1W; TC: ±100ppm/°C; PressFit: No; Part Number: R0603_10K_1%_0.1W_100PPM; Component Kind: Standard; Component Type: Standard; Pin Count: 2; Value: 10k; Status: Preferred; Tolerance: ±1%; Manufacturer Part Number: R0603_10K_1%_0.1W_100PPM; Case: 0603; Mounted: Yes; Sense: No; Socket: No; SMD: Yes; Manufacturer1 Example: NIC COMPONENT; Manufacturer1 ComponentHeight: 0.55mm; HelpURL: \\cern.ch\dfs\Applications\Altium\Datasheets\R0603_NIC_NRC.pdf; Author: CERN DEM JLC; CreateDate: 03.12.2007; LatestRevisionDate: 13.03.2008
R?#10 R?#18 = R0603_47K_1%_0.1W_100PPM: Resistor - 1%; Part Description: General Purpose Thick Film Chip Resistor; Manufacturer: GENERIC; Manufacturer1 Part Number: NRC06F4702TRF; Power: 0.1W; TC: ±100ppm/°C; PressFit: No; Part Number: R0603_47K_1%_0.1W_100PPM; Component Kind: Standard; Component Type: Standard; Pin Count: 2; Value: 47k; Status: Preferred; Tolerance: ±1%; Manufacturer Part Number: R0603_47K_1%_0.1W_100PPM; Case: 0603; Mounted: Yes; Sense: No; Socket: No; SMD: Yes; Manufacturer1 Example: NIC COMPONENT; Manufacturer1 ComponentHeight: 0.55mm; HelpURL: \\cern.ch\dfs\Applications\Altium\Datasheets\R0603_NIC_NRC.pdf; Author: CERN DEM JLC; CreateDate: 03.12.2007; LatestRevisionDate: 13.03.2008
R?#15 = R0603_4K7_1%_0.1W_100PPM: Resistor - 1%; Part Description: General Purpose Thick Film Chip Resistor; Manufacturer: GENERIC; Manufacturer1 Part Number: NRC06F4701TRF; Power: 0.1W; TC: ±100ppm/°C; PressFit: No; Part Number: R0603_4K7_1%_0.1W_100PPM; Component Kind: Standard; Component Type: Standard; Pin Count: 2; Value: 4k7; Status: Preferred; Tolerance: ±1%; Manufacturer Part Number: R0603_4K7_1%_0.1W_100PPM; Case: 0603; Mounted: Yes; Sense: No; Socket: No; SMD: Yes; Manufacturer1 Example: NIC COMPONENT; Manufacturer1 ComponentHeight: 0.55mm; HelpURL: \\cern.ch\dfs\Applications\Altium\Datasheets\R0603_NIC_NRC.pdf; Author: CERN DEM JLC; CreateDate: 03.12.2007; LatestRevisionDate: 13.03.2008
R?#17 = R0603_100K_1%_0.1W_100PPM: Resistor - 1%; Part Description: General Purpose Thick Film Chip Resistor; Manufacturer: GENERIC; Manufacturer1 Part Number: NRC06F1003TRF; Power: 0.1W; TC: ±100ppm/°C; PressFit: No; Part Number: R0603_100K_1%_0.1W_100PPM; Component Kind: Standard; Component Type: Standard; Pin Count: 2; Value: 100k; Status: Preferred; Tolerance: ±1%; Manufacturer Part Number: R0603_100K_1%_0.1W_100PPM; Case: 0603; Mounted: Yes; Sense: No; Socket: No; SMD: Yes; Manufacturer1 Example: NIC COMPONENT; Manufacturer1 ComponentHeight: 0.55mm; HelpURL: \\cern.ch\dfs\Applications\Altium\Datasheets\R0603_NIC_NRC.pdf; Author: CERN DEM JLC; CreateDate: 03.12.2007; LatestRevisionDate: 13.03.2008
R?#21 = R0805_1K_1%_0.33W_100PPM_VISHAY_CRCW-HP: Resistor - 1%; Part Description: 150V, Pulse Proof, High Power Thick Film Chip Resistor; Manufacturer: VISHAY DRALORIC; Manufacturer Part Number: CRCW08051K00FKEAHP; Value: 1k; Power: 0.33W; TC: ±100ppm/°C; PressFit: No; Part Number: R0805_1K_1%_0.33W_100PPM_VISHAY_CRCW-HP; Component Kind: Standard; Component Type: Standard; Pin Count: 2; Status: None; Tolerance: ±1%; Case: 0805; Mounted: Yes; Sense: No; Socket: No; SMD: Yes; Manufacturer1 ComponentHeight: 0.6mm; HelpURL: \\cern.ch\dfs\Applications\Altium\Datasheets\R0805_VISHAY_CRCW-HP e3.pdf; Author: CERN DEM JLC; CreateDate: 16.06.2010; LatestRevisionDate: 16.06.2010
R?#22 R?#25 = R0805_100K_1%_0.125W_100PPM: Resistor - 1%; Part Description: General Purpose Thick Film Chip Resistor; Manufacturer: GENERIC; Manufacturer1 Part Number: NRC10F1003TRF; Value: 100k; Power: 0.125W; TC: ±100ppm/°C; PressFit: No; Part Number: R0805_100K_1%_0.125W_100PPM; Component Kind: Standard; Component Type: Standard; Pin Count: 2; Status: Preferred; Tolerance: ±1%; Manufacturer Part Number: R0805_100K_1%_0.125W_100PPM; Case: 0805; Mounted: Yes; Sense: No; Socket: No; SMD: Yes; Manufacturer1 Example: NIC COMPONENT; Manufacturer1 ComponentHeight: 0.6mm; HelpURL: \\cern.ch\dfs\Applications\Altium\Datasheets\R0805_NIC_NRC.pdf; Author: CERN DEM JLC; CreateDate: 03.12.2007; LatestRevisionDate: 13.03.2008
R?#23 = R0805_46K4_0.1%_0.1W_10PPM: Resistor - 0.1%; Part Description: Thin Film Chip Resistor; Manufacturer: GENERIC; Manufacturer1 Part Number: RN73C2A46K4BTG; Power: 0.1W; TC: ±10ppm; PressFit: No; Part Number: R0805_46K4_0.1%_0.1W_10PPM; Component Kind: Standard; Component Type: Standard; Pin Count: 2; Value: 46k4; Status: Not Recommended; Tolerance: ±0.1%; Manufacturer Part Number: R0805_46K4_0.1%_0.1W_10PPM; Case: 0805; Mounted: Yes; Sense: No; Socket: No; SMD: Yes; Manufacturer1 Example: TYCO HOLSWORTHY; Manufacturer1 ComponentHeight: 0.6mm; HelpURL: \\cern.ch\dfs\Applications\Altium\Datasheets\R0805_Tyco_RN73.pdf; Author: CERN DEM JLC; CreateDate: 03.12.2007; LatestRevisionDate: 13.03.2008
R?#24 = R0805_100K_1%_0.125W_100PPM: Resistor - 1%; Part Description: General Purpose Thick Film Chip Resistor; Manufacturer: GENERIC; Manufacturer1 Part Number: NRC10F1003TRF; Power: 0.125W; TC: ±100ppm/°C; PressFit: No; Part Number: R0805_100K_1%_0.125W_100PPM; Component Kind: Standard; Component Type: Standard; Pin Count: 2; Value: 100k; Status: Preferred; Tolerance: ±1%; Manufacturer Part Number: R0805_100K_1%_0.125W_100PPM; Case: 0805; Mounted: Yes; Sense: No; Socket: No; SMD: Yes; Manufacturer1 Example: NIC COMPONENT; Manufacturer1 ComponentHeight: 0.6mm; HelpURL: \\cern.ch\dfs\Applications\Altium\Datasheets\R0805_NIC_NRC.pdf; Author: CERN DEM JLC; CreateDate: 03.12.2007; LatestRevisionDate: 13.03.2008
R?#26 = R0805_3K16_0.1%_0.1W_10PPM: Resistor - 0.1%; Part Description: Thin Film Chip Resistor; Manufacturer: GENERIC; Manufacturer1 Part Number: RN73C2A3K16BTG; Power: 0.1W; TC: ±10ppm; PressFit: No; Part Number: R0805_3K16_0.1%_0.1W_10PPM; Component Kind: Standard; Component Type: Standard; Pin Count: 2; Value: 3k16; Status: Not Recommended; Tolerance: ±0.1%; Manufacturer Part Number: R0805_3K16_0.1%_0.1W_10PPM; Case: 0805; Mounted: Yes; Sense: No; Socket: No; SMD: Yes; Manufacturer1 Example: TYCO HOLSWORTHY; Manufacturer1 ComponentHeight: 0.6mm; HelpURL: \\cern.ch\dfs\Applications\Altium\Datasheets\R0805_Tyco_RN73.pdf; Author: CERN DEM JLC; CreateDate: 03.12.2007; LatestRevisionDate: 13.03.2008
R?#27 = R0805_1K_1%_0.125W_100PPM: Resistor - 1%; Part Description: General Purpose Thick Film Chip Resistor; Manufacturer: GENERIC; Manufacturer1 Part Number: NRC10F1001TRF; Power: 0.125W; TC: ±100ppm/°C; PressFit: No; Part Number: R0805_1K_1%_0.125W_100PPM; Component Kind: Standard; Component Type: Standard; Pin Count: 2; Value: 1k; Status: Preferred; Tolerance: ±1%; Manufacturer Part Number: R0805_1K_1%_0.125W_100PPM; Case: 0805; Mounted: Yes; Sense: No; Socket: No; SMD: Yes; Manufacturer1 Example: NIC COMPONENT; Manufacturer1 ComponentHeight: 0.6mm; HelpURL: \\cern.ch\dfs\Applications\Altium\Datasheets\R0805_NIC_NRC.pdf; Author: CERN DEM JLC; CreateDate: 12/3/2007; LatestRevisionDate: 3/13/2008
R?#28 = R1206_24R_1%_0.25W_100PPM: Resistor - 1%; Part Description: General Purpose Thick Film Chip Resistor; Manufacturer: GENERIC; Manufacturer1 Part Number: NRC12F24R0TRF; Power: 0.25W; TC: ±100ppm/°C; PressFit: No; Part Number: R1206_24R_1%_0.25W_100PPM; Component Kind: Standard; Component Type: Standard; Pin Count: 2; Value: 470R; Status: Preferred; Tolerance: ±1%; Manufacturer Part Number: R1206_24R_1%_0.25W_100PPM; Case: 1206; Mounted: Yes; Sense: No; Socket: No; SMD: Yes; Manufacturer1 Example: NIC COMPONENT; Manufacturer1 ComponentHeight: 0.65mm; HelpURL: \\cern.ch\dfs\Applications\Altium\Datasheets\R1206_NIC_NRC.pdf; Author: CERN DEM JLC; CreateDate: 12/3/2007; LatestRevisionDate: 3/13/2008
R?#29 R?#30 = R1210_49R9_1%_0.5W_100PPM_VISHAY_CRCW: Resistor - 1%; Part Description: Thick Film Chip Resistor; Manufacturer: VISHAY DRALORIC; Manufacturer Part Number: CRCW121049R9FKTA; Value: 49R9; Power: 0.5W; TC: ±100ppm/°C; PressFit: No; Part Number: R1210_49R9_1%_0.5W_100PPM_VISHAY_CRCW; Component Kind: Standard; Component Type: Standard; Pin Count: 2; Status: None; Tolerance: ±1%; Case: 1210; Mounted: Yes; Sense: No; Socket: No; SMD: Yes; ComponentHeight: 0.6mm; HelpURL: \\cern.ch\dfs\Applications\Altium\Datasheets\R1210_VISHAY_CRCW1210.pdf; Author: CERN DEM JMW; CreateDate: 8/6/2014; LatestRevisionDate: 8/6/2014
R?#31 R?#39-R?#42 = R0805_0R_JUMPER: Resistor; Part Description: 2A (0.05R Max DC Resistance) Zero Ohm Jumper; Manufacturer: GENERIC; Manufacturer1 Part Number: NRC10Z0; PressFit: No; Part Number: R0805_0R_JUMPER; Component Kind: Standard; Component Type: Standard; Pin Count: 2; Value: 0; Status: Preferred; Manufacturer Part Number: R0805_0R_JUMPER; Case: 0805; Mounted: Yes; Sense: No; Socket: No; SMD: Yes; Manufacturer1 Example: NIC COMPONENT; Manufacturer1 ComponentHeight: 0.6mm; HelpURL: \\cern.ch\dfs\Applications\Altium\Datasheets\R0805_NIC_NRC.pdf; Author: CERN DEM JLC; CreateDate: 03.12.2007; LatestRevisionDate: 13.03.2008
R?#33 = R0805_200K_1%_0.125W_100PPM: Resistor - 1%; Part Description: General Purpose Thick Film Chip Resistor; Manufacturer: GENERIC; Manufacturer1 Part Number: NRC10F2003TRF; Power: 0.125W; TC: ±100ppm/°C; PressFit: No; Part Number: R0805_200K_1%_0.125W_100PPM; Component Kind: Standard; Component Type: Standard; Pin Count: 2; Value: 200k; Status: Preferred; Tolerance: ±1%; Manufacturer Part Number: R0805_200K_1%_0.125W_100PPM; Case: 0805; Mounted: Yes; Sense: No; Socket: No; SMD: Yes; Manufacturer1 Example: NIC COMPONENT; Manufacturer1 ComponentHeight: 0.6mm; HelpURL: \\cern.ch\dfs\Applications\Altium\Datasheets\R0805_NIC_NRC.pdf; Author: CERN DEM JLC; CreateDate: 03.12.2007; LatestRevisionDate: 13.03.2008
R?#34 R?#37 = R0805_10K_1%_0.125W_100PPM: Resistor - 1%; Part Description: General Purpose Thick Film Chip Resistor; Manufacturer: GENERIC; Manufacturer1 Part Number: NRC10F1002TRF; Power: 0.125W; TC: ±100ppm/°C; PressFit: No; Part Number: R0805_10K_1%_0.125W_100PPM; Component Kind: Standard; Component Type: Standard; Pin Count: 2; Value: 10k; Status: Preferred; Tolerance: ±1%; Manufacturer Part Number: R0805_10K_1%_0.125W_100PPM; Case: 0805; Mounted: Yes; Sense: No; Socket: No; SMD: Yes; Manufacturer1 Example: NIC COMPONENT; Manufacturer1 ComponentHeight: 0.6mm; HelpURL: \\cern.ch\dfs\Applications\Altium\Datasheets\R0805_NIC_NRC.pdf; Author: CERN DEM JLC; CreateDate: 12/3/2007; LatestRevisionDate: 3/13/2008
R?#35 = R0805_15K_1%_0.125W_100PPM: Resistor - 1%; Part Description: General Purpose Thick Film Chip Resistor; Manufacturer: GENERIC; Manufacturer1 Part Number: NRC10F1502TRF; Power: 0.125W; TC: ±100ppm/°C; PressFit: No; Part Number: R0805_15K_1%_0.125W_100PPM; Component Kind: Standard; Component Type: Standard; Pin Count: 2; Value: 15k; Status: Preferred; Tolerance: ±1%; Manufacturer Part Number: R0805_15K_1%_0.125W_100PPM; Case: 0805; Mounted: Yes; Sense: No; Socket: No; SMD: Yes; Manufacturer1 Example: NIC COMPONENT; Manufacturer1 ComponentHeight: 0.6mm; HelpURL: \\cern.ch\dfs\Applications\Altium\Datasheets\R0805_NIC_NRC.pdf; Author: CERN DEM JLC; CreateDate: 5/13/2013; LatestRevisionDate: 5/13/2013
R?#36 = R0805_3K9_1%_0.125W_100PPM: Resistor - 1%; Part Description: General Purpose Thick Film Chip Resistor; Manufacturer: GENERIC; Manufacturer1 Part Number: NRC10F3901TRF; Power: 0.125W; TC: ±100ppm/°C; PressFit: No; Part Number: R0805_3K9_1%_0.125W_100PPM; Component Kind: Standard; Component Type: Standard; Pin Count: 2; Value: 3k9; Status: Preferred; Tolerance: ±1%; Manufacturer Part Number: R0805_3K9_1%_0.125W_100PPM; Case: 0805; Mounted: Yes; Sense: No; Socket: No; SMD: Yes; Manufacturer1 Example: NIC COMPONENT; Manufacturer1 ComponentHeight: 0.6mm; HelpURL: \\cern.ch\dfs\Applications\Altium\Datasheets\R0805_NIC_NRC.pdf; Author: CERN DEM JLC; CreateDate: 03.12.2007; LatestRevisionDate: 13.03.2008
T?#1 = IRF9630SPBF: P-CHANNEL MOSFET WITH DIODE; Part Description: -200V -6.5A P-Channel Power MOSFET; Manufacturer: INTERNATIONAL RECTIFIER; PressFit: No; Bonding: No; Part Number: IRF9630SPBF; Component Kind: Standard; Component Type: Standard; Device: 25P06; PackageDescription: D2PAK TO-263AB TO, 2.54mm pitch; 2 pin, 15.245mm L X 9.515mm W X 4.83mm H body, IPC Medium Density; Manufacturer Part Number: IRF9630SPBF; Pin Count: 3; Case: D2PAK; Mounted: Yes; Socket: No; SMD: Yes; Sense: No; ComponentHeight: 4.83mm; HelpURL: \\cern.ch\dfs\Applications\Altium\Datasheets\IRF9630SPBF.pdf; Author: CERN DEM JLC; CreateDate: 14.02.2017; LatestRevisionDate: 14.02.2017
T?#2 T?#4 T?#5 = MMBT3904: NPN Transistor; Part Description: 40V 200mA NPN Switching Transistor; Manufacturer: NXP SEMICONDUCTORS; PressFit: No; Bonding: No; Part Number: MMBT3904; Component Kind: Standard; Component Type: Standard; Device: MMBT3904; PackageDescription: SOT23, 3 pin, Pitch 0.95mm - 1.3mm W X 2.9mm L X 1.1mm H, IPC Medium Density; Manufacturer Part Number: MMBT3904; Pin Count: 3; Case: SOT23-3; Mounted: Yes; Socket: No; SMD: Yes; Sense: No; ComponentHeight: 1.1mm; HelpURL: \\cern.ch\dfs\Applications\Altium\Datasheets\MMBT3904.pdf; Author: CERN DEM JLC; CreateDate: 10.02.2010; LatestRevisionDate: 10.02.2010
T?#3 = NDS0605: P-CHANNEL MOSFET WITH DIODE; Part Description: -60V -0.18A P-Channel Enhancement Mode Field Effect Transistor; Manufacturer: FAIRCHILD SEMICONDUCTOR; PressFit: No; Bonding: No; Part Number: NDS0605; Component Kind: Standard; Component Type: Standard; Device: g3035; PackageDescription: SOT23 3-Leads, Pitch 0.95mm - Body 1.3x2.9mm, IPC Medium Density; Manufacturer Part Number: NDS0605; Pin Count: 3; Case: SOT23-3; Mounted: Yes; Socket: No; SMD: Yes; Sense: No; ComponentHeight: 1.3mm; HelpURL: \\cern.ch\dfs\Applications\Altium\Datasheets\NDS0605.pdf; Author: CERN DEM JLC; CreateDate: 30.03.2010; LatestRevisionDate: 30.03.2010
T?#6-T?#9 = IRFR224PBF: N-CHANNEL MOSFET WITH DIODE; Part Description: 250V 3.8A N-Channel Power MOSFET; Manufacturer: VISHAY SILICONIX; PressFit: No; Bonding: No; Part Number: IRFR224PBF; Component Kind: Standard; Component Type: Standard; Device: HY4008; PackageDescription: TO-252AA DPAK TO, 2.28mm pitch; 2 pin,9.905mm L X 6.095mm W X 2.39mm H body, IPC Medium Density; Manufacturer Part Number: IRFR224PBF; Pin Count: 3; Case: DPAK; Mounted: Yes; Socket: No; SMD: Yes; Sense: No; ComponentHeight: 2.38mm; HelpURL: \\cern.ch\dfs\Applications\Altium\Datasheets\IRFR224PBF.pdf; Author: CERN DEM JLC; CreateDate: 25.07.2012; LatestRevisionDate: 25.07.2012
U3 = L7805ABD2T-TR: 3-Terminal Regulator 1=IN 2=OUT 3=GND; Part Description: 5V 1.5A Positive Voltage Regulator; Manufacturer: ST MICROELECTRONICS; PressFit: No; Bonding: No; Part Number: L7805ABD2T-TR; Component Kind: Standard; Component Type: Standard; Device: L7805ABD2T-TR; PackageDescription: D2PAK TO-263, TO, 2.54mm pitch; 2 pin,15.425mm L X 9.15mm W X 4.60mm H body, IPC Medium Density; Manufacturer Part Number: L7805ABD2T-TR; Pin Count: 3; Case: TO-263; Mounted: Yes; Socket: No; SMD: Yes; Sense: No; ComponentHeight: 4.6mm; HelpURL: \\cern.ch\dfs\Applications\Altium\Datasheets\L7805ABD2T-TR.pdf; Author: CERN DEM JLC; CreateDate: 13.12.2011; LatestRevisionDate: 13.12.2011
U5 = SRV05-4.TCT: No Description Available; Built_By: EMA_Justin; Vendor: Semtech Corporation; Copyright: Copyright (C) 2016 Accelerated Designs. All rights reserved; Manufacturer_Part_Number: SRV05-4.TCT; RefDes: RefDes; Type: DEV; Value: Value